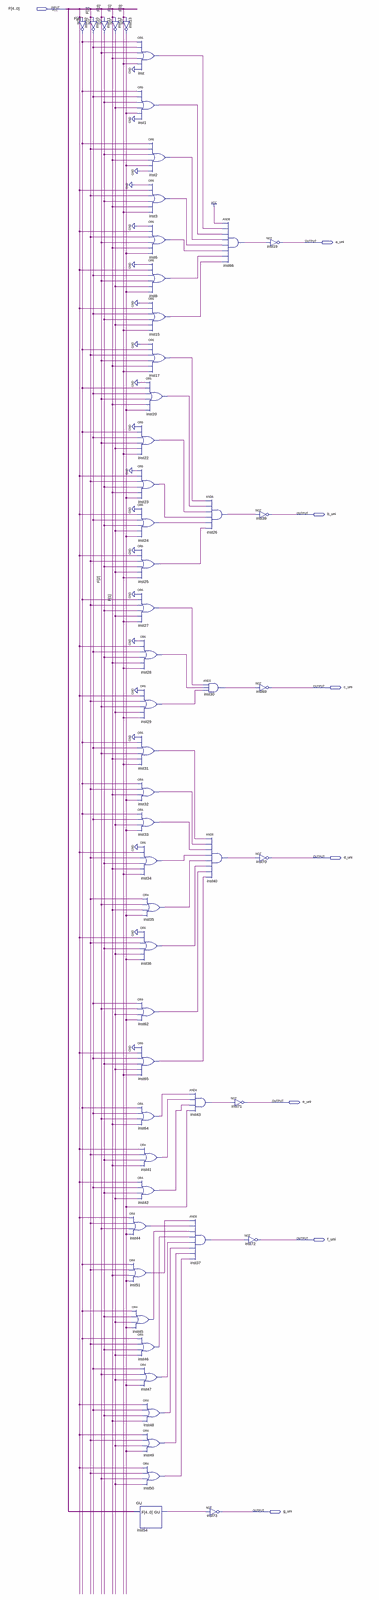
[diagram p0: schematic sheet, whole]
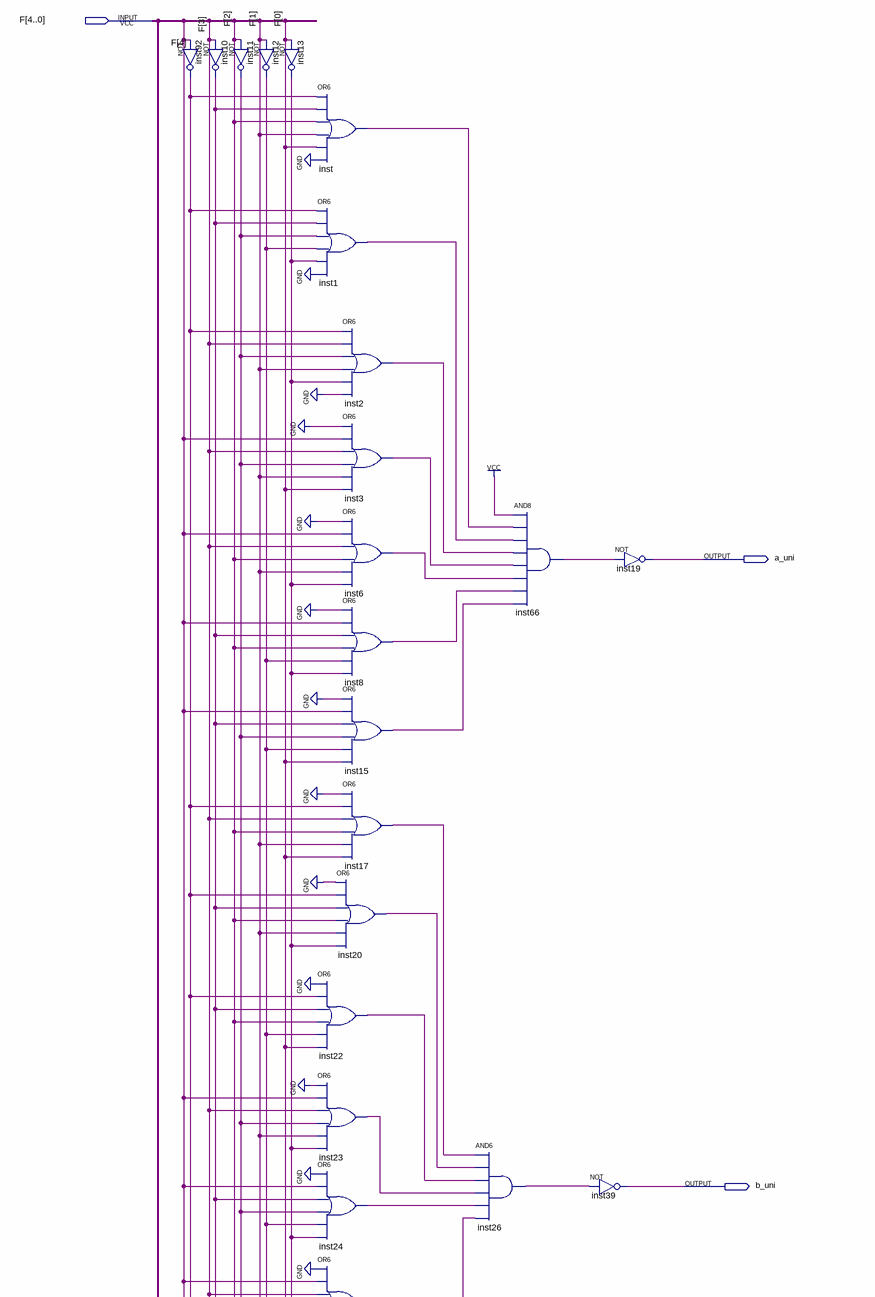
[diagram p1: schematic sheet, upper part]
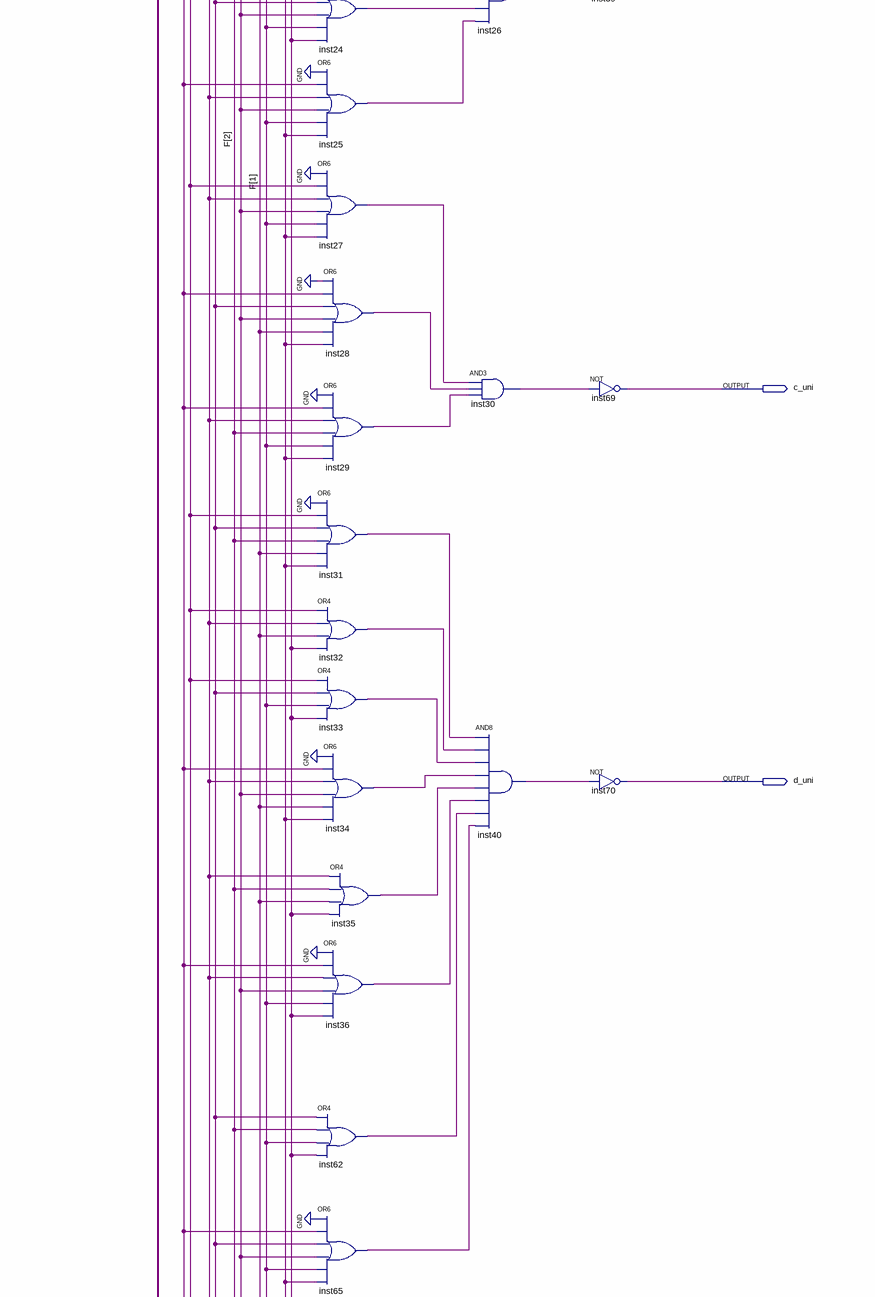
[diagram p2: schematic sheet, middle part]
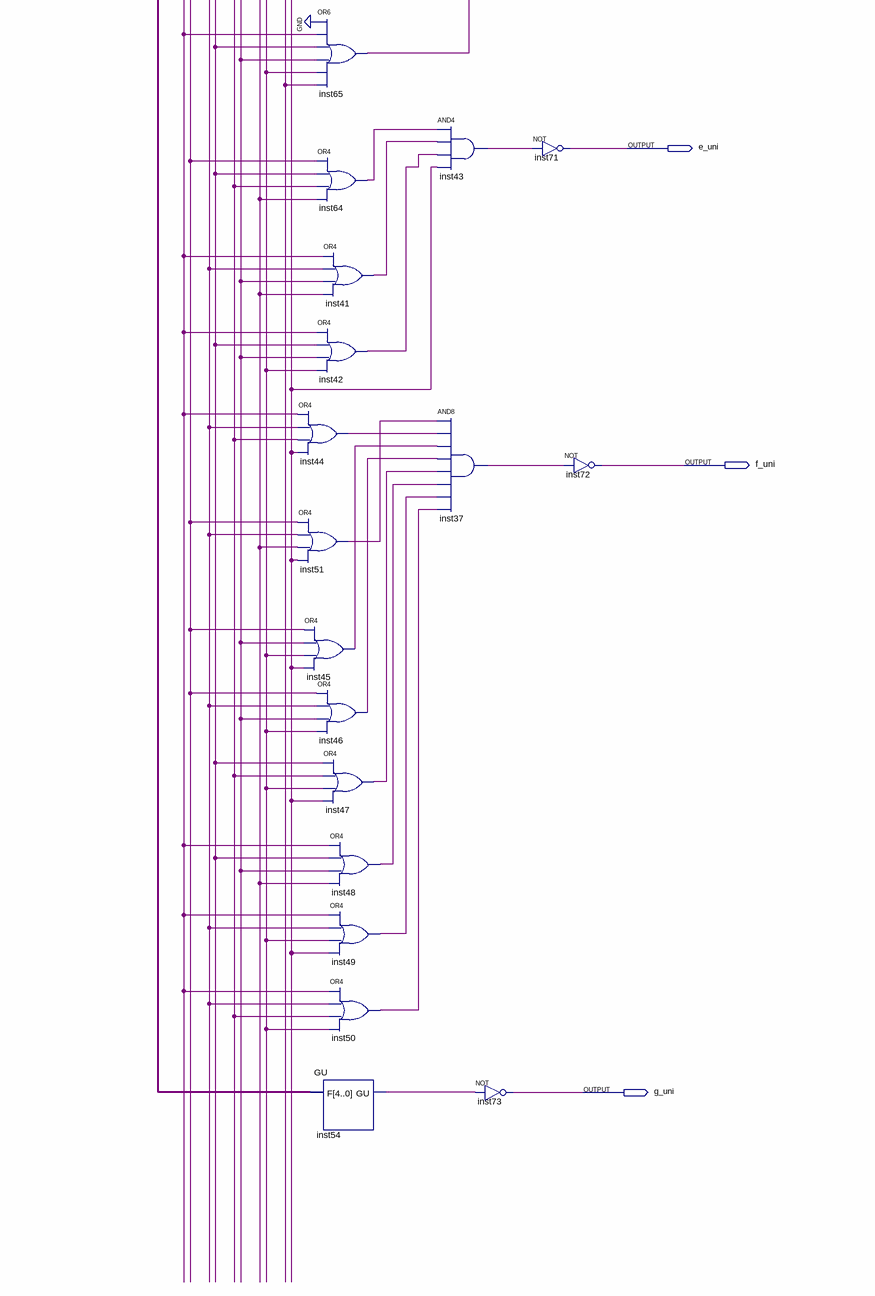
[diagram p3: schematic sheet, lower part]
// Quartus schematic Display_Unidades.bdf as structural Verilog: 54 symbols, 8 pins
module Display_Unidades (
  input  [4:0] F,
  output a_uni,
  output b_uni,
  output c_uni,
  output d_uni,
  output e_uni,
  output f_uni,
  output g_uni
);

  wire inst1_out, inst2_out, inst3_out, inst6_out, inst8_out, inst10_out, inst11_out, inst12_out, inst13_out,
       inst15_out, inst17_out, inst20_out, inst22_out, inst23_out, inst24_out, inst25_out, inst26_out,
       inst27_out, inst28_out, inst29_out, inst30_out, inst31_out, inst32_out, inst33_out, inst34_out,
       inst35_out, inst36_out, inst37_out, inst40_out, inst41_out, inst42_out, inst43_out, inst44_out,
       inst45_out, inst46_out, inst47_out, inst48_out, inst49_out, inst50_out, inst51_out, inst54_gu,
       inst62_out, inst64_out, inst65_out, inst66_out, inst92_out, inst_out;

  not inst10 (inst10_out, F[3]);
  not inst92 (inst92_out, F[4]);
  not inst11 (inst11_out, F[2]);
  not inst12 (inst12_out, F[1]);
  not inst13 (inst13_out, F[0]);
  or inst44 (inst44_out, F[4], F[3], F[2], inst13_out);
  or inst51 (inst51_out, inst92_out, F[3], F[1], inst13_out);
  or inst45 (inst45_out, inst92_out, inst11_out, inst12_out, inst13_out);
  GU inst54 (.F(F), .GU(inst54_gu));
  or inst (inst_out, inst92_out, inst10_out, F[2], F[1], F[0], 1'b0);
  or inst1 (inst1_out, inst92_out, inst10_out, inst11_out, inst12_out, inst13_out, 1'b0);
  or inst2 (inst2_out, inst92_out, F[3], inst11_out, F[1], inst13_out, 1'b0);
  or inst3 (inst3_out, 1'b0, F[4], F[3], inst11_out, F[1], F[0]);
  or inst6 (inst6_out, 1'b0, F[4], F[3], F[2], F[1], inst13_out);
  or inst8 (inst8_out, 1'b0, F[4], inst10_out, F[2], inst12_out, inst13_out);
  or inst15 (inst15_out, 1'b0, F[4], inst10_out, inst11_out, inst12_out, F[0]);
  or inst17 (inst17_out, 1'b0, inst92_out, F[3], F[2], F[1], F[0]);
  or inst20 (inst20_out, 1'b0, inst92_out, inst10_out, F[2], F[1], inst13_out);
  or inst22 (inst22_out, 1'b0, inst92_out, inst10_out, F[2], inst12_out, F[0]);
  or inst23 (inst23_out, 1'b0, F[4], F[3], inst11_out, F[1], inst13_out);
  or inst24 (inst24_out, 1'b0, F[4], inst10_out, inst11_out, inst12_out, inst13_out);
  or inst25 (inst25_out, 1'b0, F[4], F[3], inst11_out, inst12_out, F[0]);
  or inst27 (inst27_out, 1'b0, inst92_out, F[3], inst11_out, inst12_out, F[0]);
  or inst28 (inst28_out, 1'b0, F[4], inst10_out, inst11_out, F[1], F[0]);
  or inst29 (inst29_out, 1'b0, F[4], F[3], F[2], inst12_out, F[0]);
  or inst31 (inst31_out, 1'b0, inst92_out, inst10_out, F[2], F[1], F[0]);
  or inst32 (inst32_out, inst92_out, F[3], F[1], inst13_out);
  or inst33 (inst33_out, inst92_out, inst10_out, inst12_out, inst13_out);
  or inst34 (inst34_out, 1'b0, F[4], F[3], inst11_out, F[1], F[0]);
  or inst35 (inst35_out, F[3], F[2], F[1], inst13_out);
  or inst36 (inst36_out, 1'b0, F[4], F[3], inst11_out, inst12_out, inst13_out);
  or inst62 (inst62_out, inst10_out, F[2], inst12_out, inst13_out);
  or inst65 (inst65_out, 1'b0, F[4], inst10_out, inst11_out, inst12_out, F[0]);
  or inst64 (inst64_out, inst92_out, inst10_out, F[2], F[1]);
  or inst41 (inst41_out, F[4], F[3], inst11_out, F[1]);
  or inst42 (inst42_out, F[4], inst10_out, inst11_out, inst12_out);
  or inst46 (inst46_out, inst92_out, F[3], inst11_out, inst12_out);
  or inst47 (inst47_out, inst10_out, F[2], inst12_out, inst13_out);
  or inst48 (inst48_out, F[4], inst10_out, inst11_out, F[1]);
  or inst49 (inst49_out, F[4], F[3], inst12_out, inst13_out);
  or inst50 (inst50_out, F[4], F[3], F[2], inst12_out);
  and inst43 (inst43_out, inst64_out, inst41_out, inst42_out, inst13_out);
  and inst37 (inst37_out, inst51_out, inst44_out, inst45_out, inst46_out, inst47_out, inst48_out, inst49_out, inst50_out);
  and inst66 (inst66_out, 1'b1, inst_out, inst1_out, inst2_out, inst3_out, inst6_out, inst8_out, inst15_out);
  and inst26 (inst26_out, inst17_out, inst20_out, inst22_out, inst23_out, inst24_out, inst25_out);
  and inst30 (inst30_out, inst27_out, inst28_out, inst29_out);
  and inst40 (inst40_out, inst31_out, inst32_out, inst33_out, inst34_out, inst35_out, inst36_out, inst62_out, inst65_out);
  not inst73 (g_uni, inst54_gu);
  not inst71 (e_uni, inst43_out);
  not inst72 (f_uni, inst37_out);
  not inst19 (a_uni, inst66_out);
  not inst39 (b_uni, inst26_out);
  not inst69 (c_uni, inst30_out);
  not inst70 (d_uni, inst40_out);
endmodule
